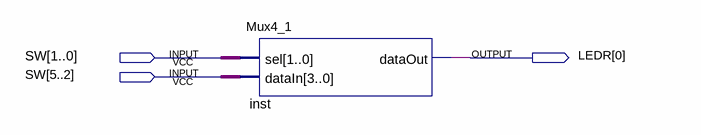
[diagram p0: schematic sheet]
// Quartus schematic Mux4_1Demo.bdf as structural Verilog: 1 symbols, 3 pins
module Mux4_1Demo (
  input  [5:0] SW,
  output [0:0] LEDR
);

  Mux4_1 inst (.sel(SW[1:0]), .dataIn(SW[5:2]), .dataOut(LEDR[0]));
endmodule
